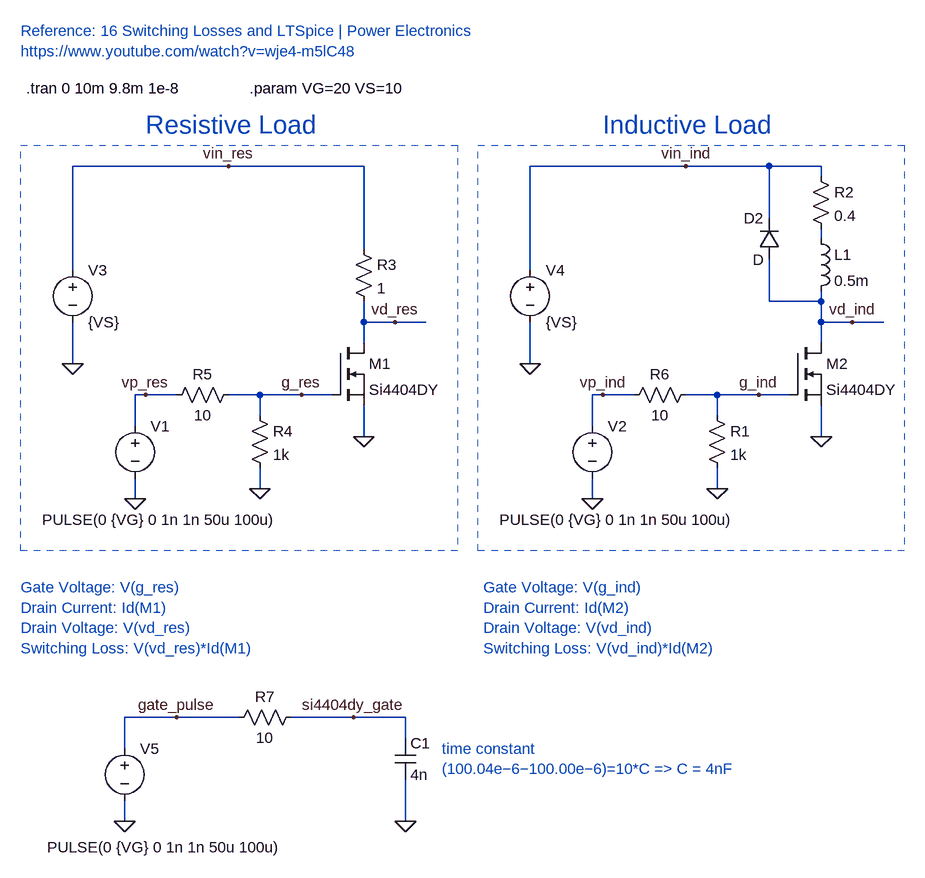
[diagram p0: schematic 03-switching_loss_resistive_inductive.asc]
03-switching_loss_resistive_inductive.asc, the LTspice schematic file:
Version 4
SHEET 1 1204 1032
WIRE 48 -32 -192 -32
WIRE 256 -32 48 -32
WIRE 752 -32 512 -32
WIRE 880 -32 752 -32
WIRE 960 -32 880 -32
WIRE 960 -16 960 -32
WIRE 880 48 880 -32
WIRE 960 80 960 64
WIRE 256 96 256 -32
WIRE -192 128 -192 -32
WIRE 512 128 512 -32
WIRE 880 176 880 112
WIRE 960 176 960 160
WIRE 960 176 880 176
WIRE 256 208 256 176
WIRE 304 208 256 208
WIRE 352 208 304 208
WIRE 960 208 960 176
WIRE 1008 208 960 208
WIRE 1056 208 1008 208
WIRE 256 240 256 208
WIRE 960 240 960 208
WIRE -192 272 -192 208
WIRE 512 272 512 208
WIRE -80 320 -96 320
WIRE -32 320 -80 320
WIRE 96 320 48 320
WIRE 160 320 96 320
WIRE 208 320 160 320
WIRE 624 320 608 320
WIRE 672 320 624 320
WIRE 800 320 752 320
WIRE 864 320 800 320
WIRE 912 320 864 320
WIRE 96 352 96 320
WIRE 800 352 800 320
WIRE -96 368 -96 320
WIRE 608 368 608 320
WIRE 256 384 256 336
WIRE 960 384 960 336
WIRE 96 464 96 432
WIRE 800 464 800 432
WIRE -96 480 -96 448
WIRE 608 480 608 448
WIRE -32 816 -112 816
WIRE 64 816 -32 816
WIRE 240 816 144 816
WIRE 320 816 240 816
WIRE 320 848 320 816
WIRE -112 864 -112 816
WIRE -112 976 -112 944
WIRE 320 976 320 912
FLAG 256 384 0
FLAG 96 464 0
FLAG -96 480 0
FLAG -192 272 0
FLAG 304 208 vd_res
FLAG -80 320 vp_res
FLAG 160 320 g_res
FLAG 48 -32 vin_res
FLAG 960 384 0
FLAG 800 464 0
FLAG 608 480 0
FLAG 512 272 0
FLAG 1008 208 vd_ind
FLAG 624 320 vp_ind
FLAG 864 320 g_ind
FLAG 752 -32 vin_ind
FLAG -112 976 0
FLAG 320 976 0
FLAG 240 816 si4404dy_gate
FLAG -32 816 gate_pulse
SYMBOL nmos 208 240 R0
SYMATTR InstName M1
SYMATTR Value Si4404DY
SYMBOL res 80 336 R0
SYMATTR InstName R4
SYMATTR Value 1k
SYMBOL res 64 304 R90
WINDOW 0 0 56 VBottom 2
WINDOW 3 32 56 VTop 2
SYMATTR InstName R5
SYMATTR Value 10
SYMBOL voltage -96 352 R0
WINDOW 3 -143 160 Left 2
WINDOW 123 0 0 Left 0
WINDOW 39 0 0 Left 0
SYMATTR Value PULSE(0 {VG} 0 1n 1n 50u 100u)
SYMATTR InstName V1
SYMBOL res 240 80 R0
SYMATTR InstName R3
SYMATTR Value 1
SYMBOL voltage -192 112 R0
WINDOW 123 0 0 Left 0
WINDOW 39 0 0 Left 0
SYMATTR InstName V3
SYMATTR Value {VS}
SYMBOL nmos 912 240 R0
SYMATTR InstName M2
SYMATTR Value Si4404DY
SYMBOL res 784 336 R0
SYMATTR InstName R1
SYMATTR Value 1k
SYMBOL res 768 304 R90
WINDOW 0 0 56 VBottom 2
WINDOW 3 32 56 VTop 2
SYMATTR InstName R6
SYMATTR Value 10
SYMBOL voltage 608 352 R0
WINDOW 3 -143 160 Left 2
WINDOW 123 0 0 Left 0
WINDOW 39 0 0 Left 0
SYMATTR Value PULSE(0 {VG} 0 1n 1n 50u 100u)
SYMATTR InstName V2
SYMBOL res 944 -32 R0
SYMATTR InstName R2
SYMATTR Value 0.4
SYMBOL voltage 512 112 R0
WINDOW 123 0 0 Left 0
WINDOW 39 0 0 Left 0
SYMATTR InstName V4
SYMATTR Value {VS}
SYMBOL ind 944 64 R0
SYMATTR InstName L1
SYMATTR Value 0.5m
SYMBOL diode 896 112 R180
WINDOW 0 24 64 Left 2
WINDOW 3 24 0 Left 2
SYMATTR InstName D2
SYMBOL voltage -112 848 R0
WINDOW 3 -119 168 Left 2
WINDOW 123 0 0 Left 0
WINDOW 39 0 0 Left 0
SYMATTR Value PULSE(0 {VG} 0 1n 1n 50u 100u)
SYMATTR InstName V5
SYMBOL res 160 800 R90
WINDOW 0 0 56 VBottom 2
WINDOW 3 32 56 VTop 2
SYMATTR InstName R7
SYMATTR Value 10
SYMBOL cap 304 848 R0
SYMATTR InstName C1
SYMATTR Value 4n
TEXT -80 -96 Left 4 ;Resistive Load
TEXT -272 -240 Left 2 ;Reference: 16 Switching Losses and LTSpice | Power Electronics\nhttps://www.youtube.com/watch?v=wje4-m5lC48
TEXT -264 -152 Left 2 !.tran 0 10m 9.8m 1e-8
TEXT 624 -96 Left 4 ;Inductive Load
TEXT -272 616 Left 2 ;Gate Voltage: V(g_res)\nDrain Current: Id(M1)\nDrain Voltage: V(vd_res)\nSwitching Loss: V(vd_res)*Id(M1)
TEXT 440 616 Left 2 ;Gate Voltage: V(g_ind)\nDrain Current: Id(M2)\nDrain Voltage: V(vd_ind)\nSwitching Loss: V(vd_ind)*Id(M2)
TEXT 80 -152 Left 2 !.param VG=20 VS=10
TEXT 376 864 Left 2 ;time constant\n(100.04e−6−100.00e−6)=10*C => C = 4nF
RECTANGLE Normal 400 560 -272 -64 1
RECTANGLE Normal 1088 560 432 -64 1

The netlist it stands for:
* 03-switching_loss_resistive_inductive.asc
M1 vd_res g_res 0 0 Si4404DY
R4 g_res 0 1k
R5 g_res vp_res 10
V1 vp_res 0 PULSE(0 {VG} 0 1n 1n 50u 100u)
R3 vin_res vd_res 1
V3 vin_res 0 {VS}
M2 vd_ind g_ind 0 0 Si4404DY
R1 g_ind 0 1k
R6 g_ind vp_ind 10
V2 vp_ind 0 PULSE(0 {VG} 0 1n 1n 50u 100u)
R2 vin_ind N001 0.4
V4 vin_ind 0 {VS}
L1 N001 vd_ind 0.5m
D2 vd_ind vin_ind D
V5 gate_pulse 0 PULSE(0 {VG} 0 1n 1n 50u 100u)
R7 si4404dy_gate gate_pulse 10
C1 si4404dy_gate 0 4n
.model D D
.lib standard.dio
.model NMOS NMOS
.model PMOS PMOS
.lib standard.mos
* Resistive Load
* Reference: 16 Switching Losses and LTSpice | Power Electronics
* https://www.youtube.com/watch?v=wje4-m5lC48
.tran 0 10m 9.8m 1e-8
* Inductive Load
* Gate Voltage: V(g_res)
* Drain Current: Id(M1)
* Drain Voltage: V(vd_res)
* Switching Loss: V(vd_res)*Id(M1)
* Gate Voltage: V(g_ind)
* Drain Current: Id(M2)
* Drain Voltage: V(vd_ind)
* Switching Loss: V(vd_ind)*Id(M2)
.param VG=20 VS=10
* time constant
* (100.04e−6−100.00e−6)=10*C => C = 4nF
.backanno
.end

* Results of the author's LTspice run, read from the files saved beside the schematic
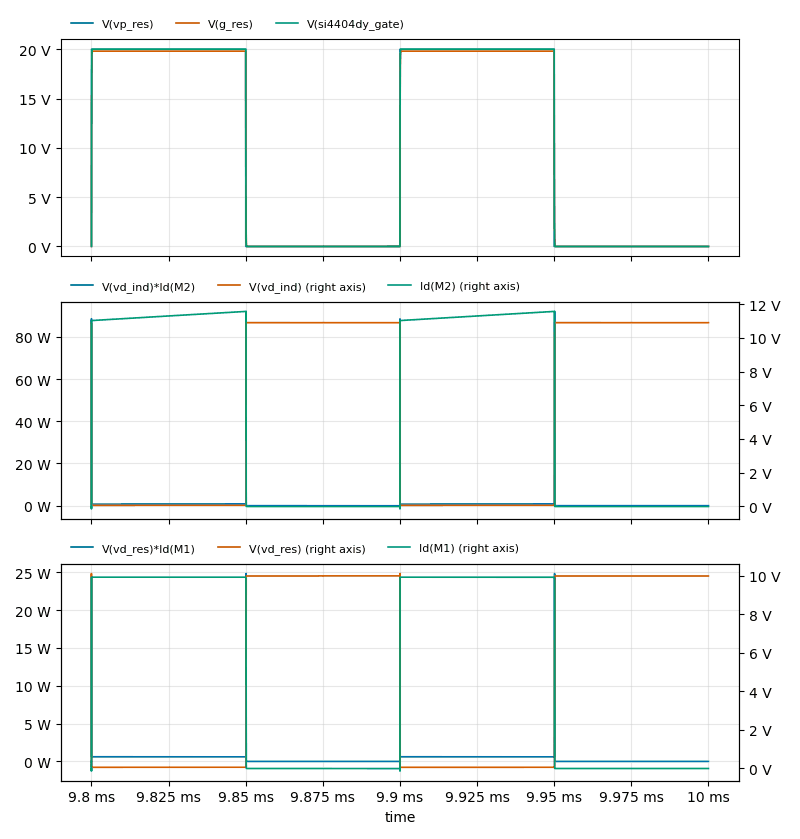
[diagram p1: Transient Analysis of 03-switching_loss_resistive_inductive.asc, plotted from the saved traces]
* Transient Analysis, 1 run:
*   V(vp_res): min 0 V, max 20 V, average 10 V, rms 14.14 V, last 0 V
*   V(g_res): min 0 V, max 19.8 V, average 9.901 V, rms 14 V, last 0 V
*   V(si4404dy_gate): min 0 V, max 20 V, average 10 V, rms 14.14 V, last 0 V
*   V(vd_ind)*Id(M2): min -1.415 W, max 92.07 W, average 415.1 mW, rms 1.18 W, last 0 W
*   V(vd_ind): min 67.77 mV, max 10.9 V, average 5.471 V, rms 7.696 V, last 10.9 V
*   Id(M2): min -129.8 mA, max 11.56 A, average 5.661 A, rms 7.997 A, last 0 A
*   V(vd_res)*Id(M1): min -1.251 W, max 24.83 W, average 314.1 mW, rms 557.6 mW, last 0 W
*   V(vd_res): min 57.73 mV, max 10.12 V, average 5.019 V, rms 7.062 V, last 10 V
*   Id(M1): min -123.6 mA, max 9.942 A, average 4.981 A, rms 7.035 A, last 0 A